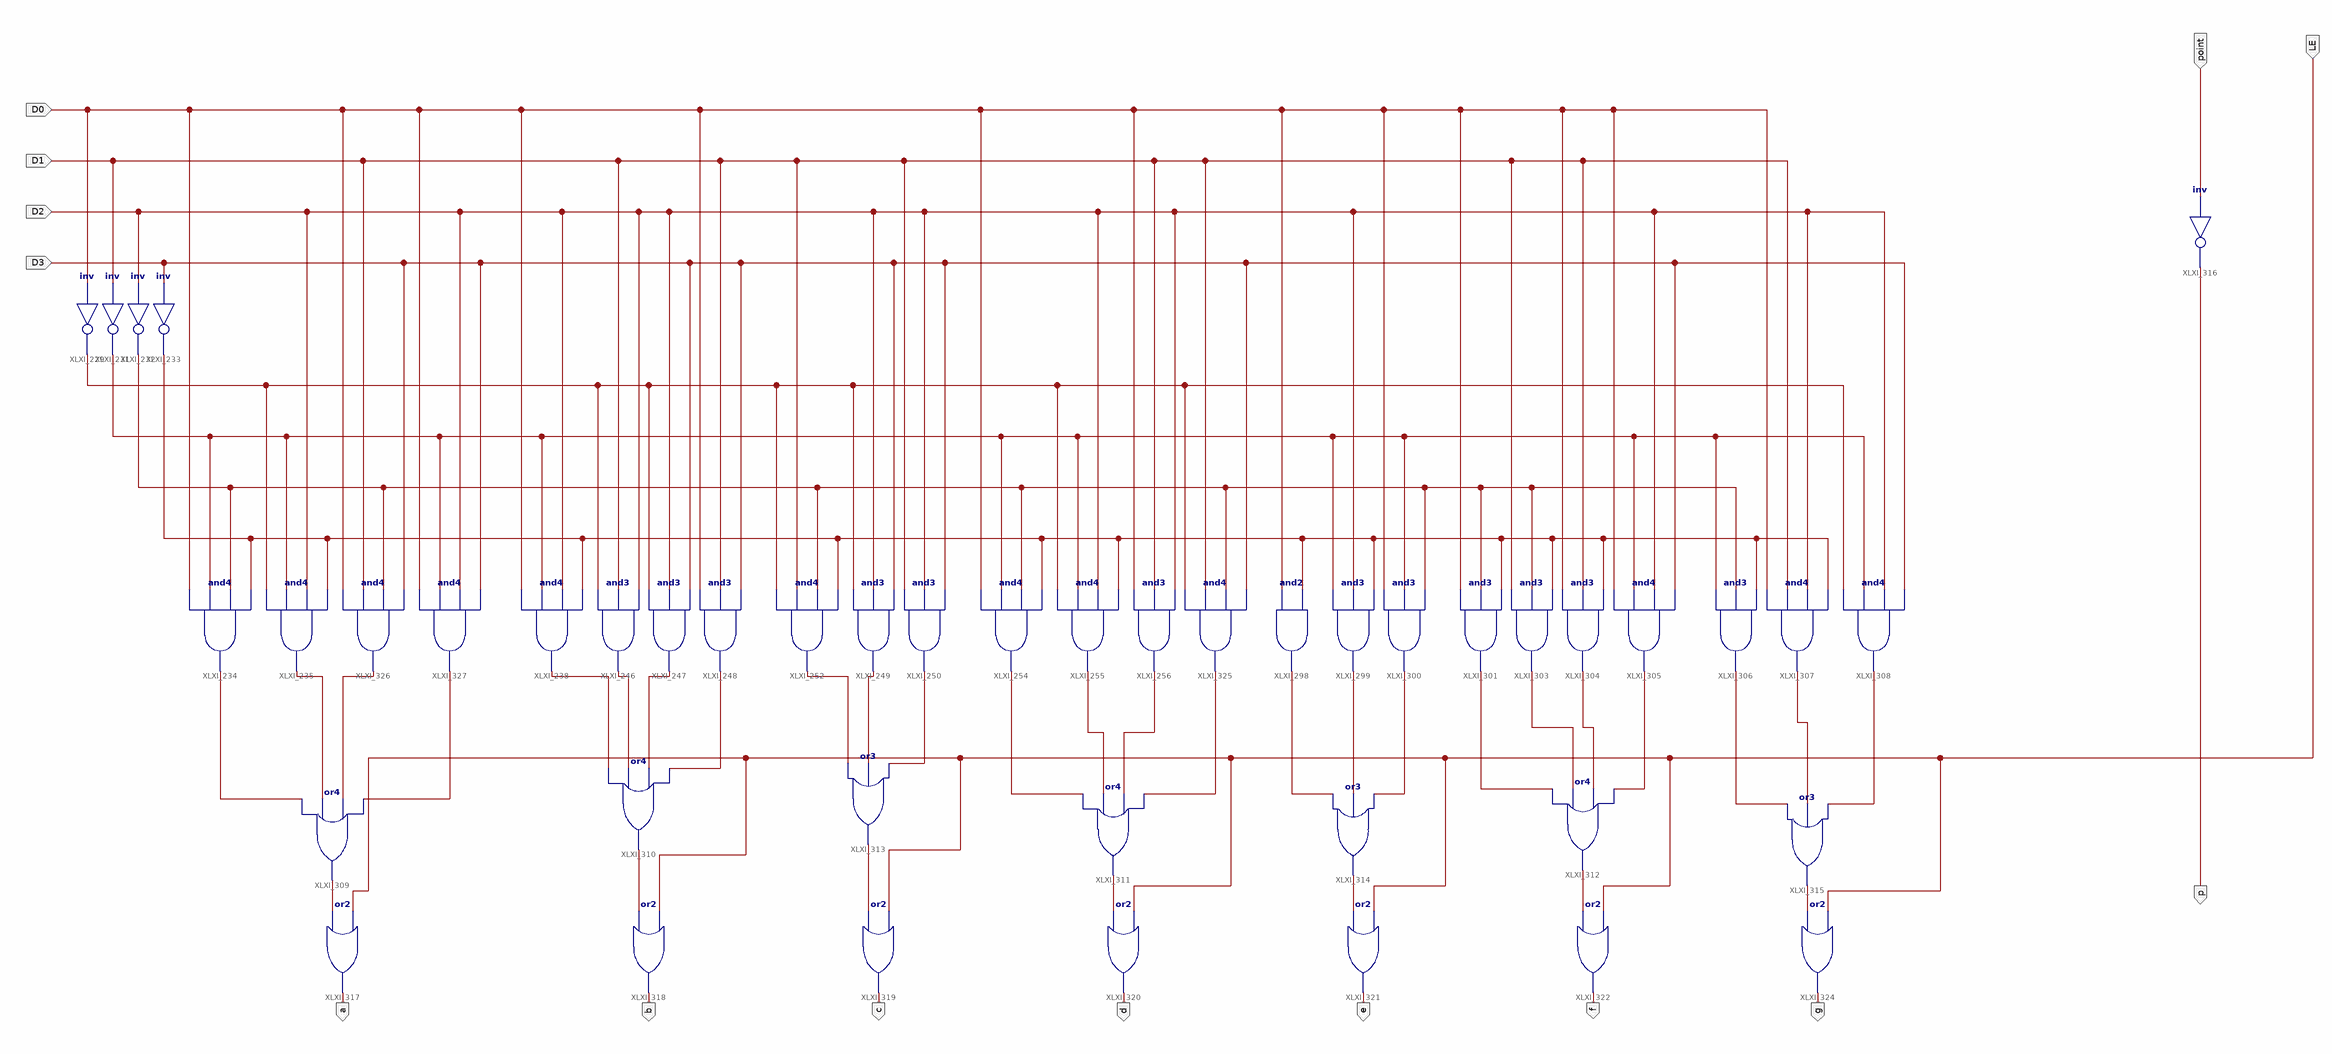
[diagram p0: schematic sheet 1]
// Xilinx ISE schematic MC14495_ZJU.sch (kintex7) as structural Verilog: 44 symbols, 14 ports
module MC14495_ZJU (
  input  D0,
  input  D1,
  input  D2,
  input  D3,
  input  point,
  input  LE,
  output p,
  output a,
  output b,
  output c,
  output d,
  output e,
  output f,
  output g
);

  wire target, XLXN_299, XLXN_300, XLXN_301, XLXN_302, XLXN_328, XLXN_329, XLXN_330, XLXN_331, XLXN_332,
       XLXN_333, XLXN_334, XLXN_337, XLXN_338, XLXN_339, XLXN_340, XLXN_341, XLXN_342, XLXN_343, XLXN_345,
       XLXN_346, XLXN_347, XLXN_348, XLXN_349, XLXN_350, XLXN_351, XLXN_352, XLXN_353, XLXN_354, XLXN_360,
       XLXN_361, XLXN_362, XLXN_363, XLXN_364, XLXN_365, XLXN_366;

  not XLXI_229 (XLXN_299, D0);
  not XLXI_231 (XLXN_300, D1);
  not XLXI_232 (XLXN_301, D2);
  not XLXI_233 (XLXN_302, D3);
  and XLXI_234 (XLXN_328, D0, XLXN_300, XLXN_301, XLXN_302);
  and XLXI_235 (XLXN_329, XLXN_299, XLXN_300, D2, XLXN_302);
  and XLXI_238 (XLXN_332, D0, XLXN_300, D2, XLXN_302);
  and XLXI_246 (XLXN_333, XLXN_299, D1, D2);
  and XLXI_247 (XLXN_334, XLXN_299, D2, D3);
  and XLXI_248 (XLXN_337, D0, D1, D3);
  and XLXI_249 (XLXN_339, XLXN_299, D2, D3);
  and XLXI_250 (XLXN_340, D1, D2, D3);
  and XLXI_252 (XLXN_338, XLXN_299, D1, XLXN_301, XLXN_302);
  and XLXI_254 (XLXN_341, D0, XLXN_300, XLXN_301, XLXN_302);
  and XLXI_255 (XLXN_342, XLXN_299, XLXN_300, D2, XLXN_302);
  and XLXI_256 (XLXN_343, D0, D1, D2);
  and XLXI_298 (XLXN_345, D0, XLXN_302);
  and XLXI_299 (XLXN_346, XLXN_300, D2, XLXN_302);
  and XLXI_300 (XLXN_347, D0, XLXN_300, XLXN_301);
  and XLXI_301 (XLXN_348, D0, XLXN_301, XLXN_302);
  and XLXI_303 (XLXN_349, D1, XLXN_301, XLXN_302);
  and XLXI_304 (XLXN_350, D0, D1, XLXN_302);
  and XLXI_305 (XLXN_351, D0, XLXN_300, D2, D3);
  and XLXI_306 (XLXN_352, XLXN_300, XLXN_301, XLXN_302);
  and XLXI_307 (XLXN_353, D0, D1, D2, XLXN_302);
  and XLXI_308 (XLXN_354, XLXN_299, XLXN_300, D2, D3);
  or XLXI_309 (XLXN_360, XLXN_328, XLXN_329, XLXN_330, XLXN_331);
  or XLXI_310 (XLXN_361, XLXN_332, XLXN_333, XLXN_334, XLXN_337);
  or XLXI_311 (XLXN_363, XLXN_341, XLXN_342, XLXN_343, target);
  or XLXI_312 (XLXN_365, XLXN_348, XLXN_349, XLXN_350, XLXN_351);
  or XLXI_313 (XLXN_362, XLXN_338, XLXN_339, XLXN_340);
  or XLXI_314 (XLXN_364, XLXN_345, XLXN_346, XLXN_347);
  or XLXI_315 (XLXN_366, XLXN_352, XLXN_353, XLXN_354);
  not XLXI_316 (p, point);
  or XLXI_317 (a, XLXN_360, LE);
  or XLXI_318 (b, XLXN_361, LE);
  or XLXI_319 (c, XLXN_362, LE);
  or XLXI_320 (d, XLXN_363, LE);
  or XLXI_321 (e, XLXN_364, LE);
  or XLXI_322 (f, XLXN_365, LE);
  or XLXI_324 (g, XLXN_366, LE);
  and XLXI_325 (target, XLXN_299, D1, XLXN_301, D3);
  and XLXI_326 (XLXN_330, D0, D1, XLXN_301, D3);
  and XLXI_327 (XLXN_331, D0, XLXN_300, D2, D3);
endmodule
